# Altium schematic sheet Схема питания и GPS Peggy Tracker.SchDoc
size 420 x 297 mm; ENG_APP_DATE: --/--/--; DSN_APP_DATE: --/--/--; CHK_APP_DATE: --/--/--; Scale: 1:1; Разраб.: Иванов; Обозначение документа: АБВГ.123456.001 Э3; Пров.: Петров; Утв.: Сидоров; Наименование организации: ОАО "Ваша фирма"; Перв. применение: АБВГ.123456.000; Наименование изделия 1: Плата; Наименование изделия 2: Схема электрическая; Наименование изделия 3: принципиальная; Нач. отд.: Нач. отд.; Фамилия нач. отд.: Сидоров
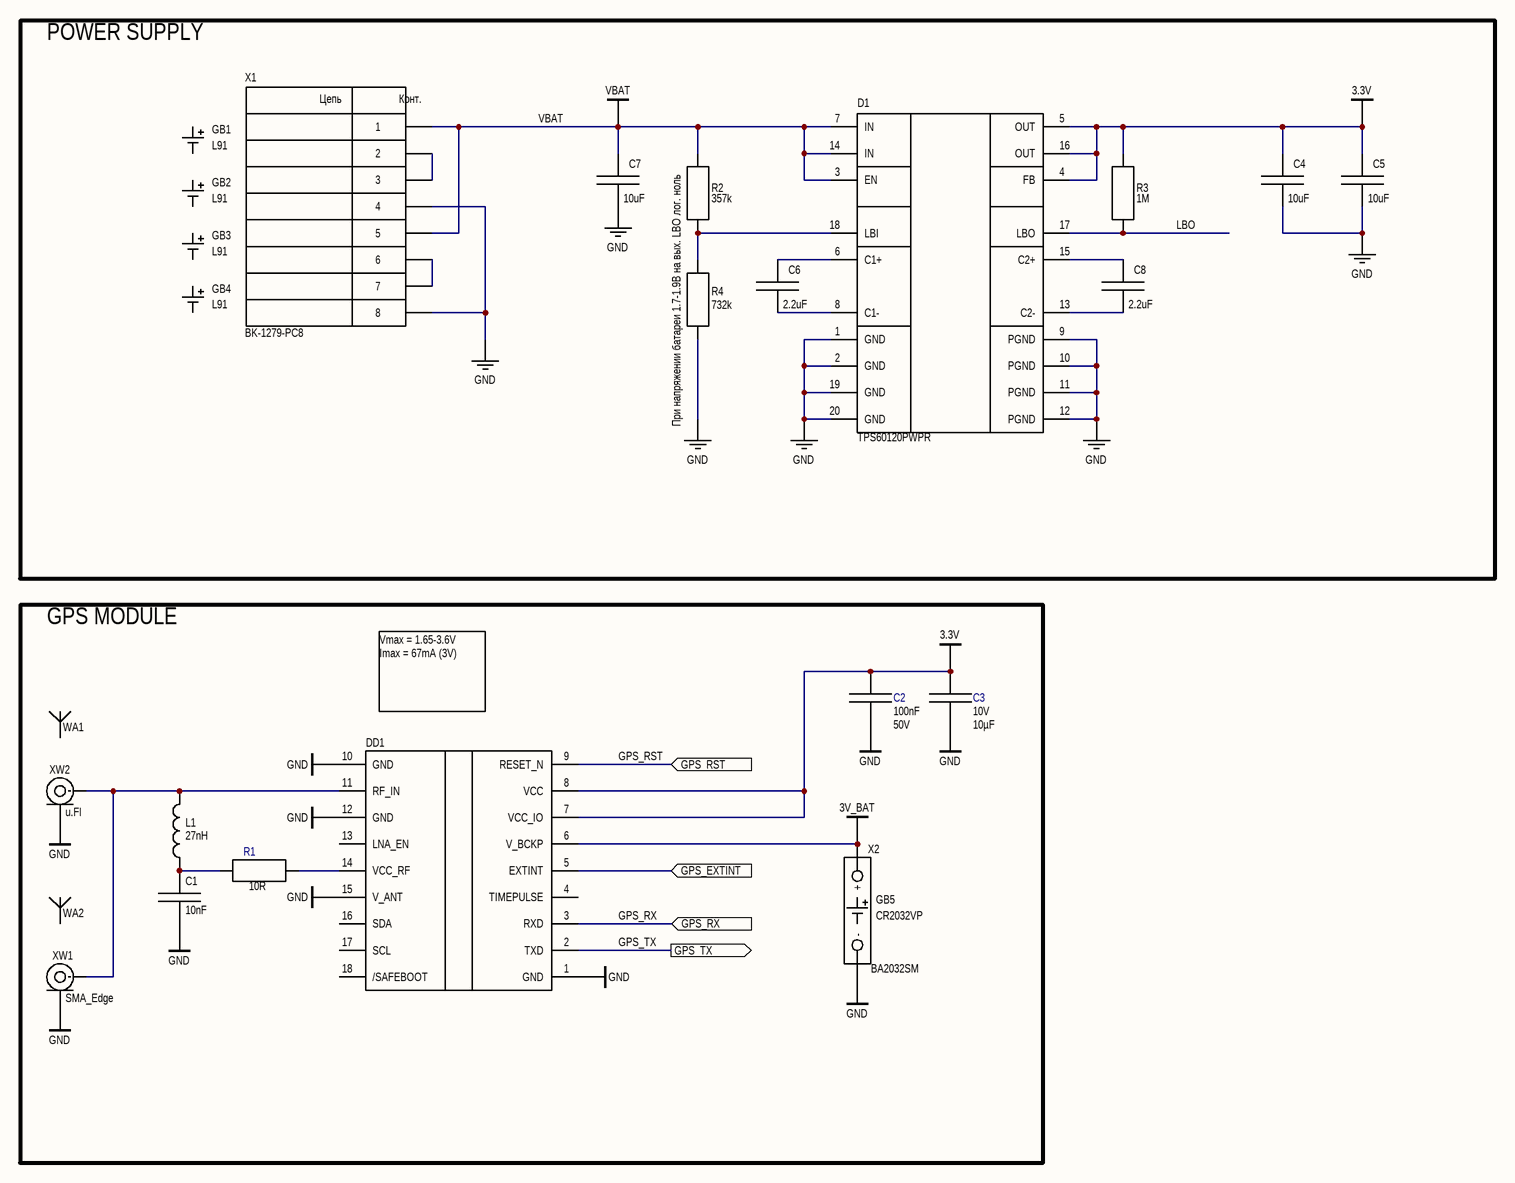
[diagram p0: Схема питания и GPS Peggy Tracker.SchDoc]

## Parts
C1  10nF  [CH0603C]
C2  value 100nF  Voltage Rating: 50V  [CAPC1608X09N]  (hidden comment: GCM188R71H104KA57D)
C3  Voltage Rating: 10V  Capacitance: 10µF  [CAPC2013X135X45NL10T25]  (hidden comment: CL21Y106KPQVPNE)
C4  10uF  [CH1206C]
C5  10uF  [CH1206C]
C6  2.2uF  [CH0805C]
C7  10uF  [CH1206C]
C8  2.2uF  [CH0805C]
D1  TPS60120PWPR  [20-TSSOP (PAD)]
DD1  MAX-M8C-0  [MOD: MAX-M8C-0]  (value not drawn)
GB1  L91
GB2  L91
GB3  L91
GB4  L91
GB5  CR2032VP
L1  27nH  [CH0603L]
R1  10R  [CH0603R]
R2  357k  [CH0603R]
R3  1M  [CH0603R]
R4  732k  [CH0603R]
WA1  CRJKS0010-LNA-G65U  (value not drawn)
WA2  MIKE3A/3M/SMAM/S/S/17  (value not drawn)
X1  BK-1279-PC8  [CON: BK-1279-PC8]
X2  BA2032SM  [CON: BA2032SM]
XW1  SMA_Edge  [CON: SMA - Edge]
XW2  u.Fl  [CON: u.Fl]

## Blocks framed on the sheet
POWER SUPPLY: C4-C8 D1 GB1-GB4 R2-R4 X1
GPS MODULE: C1-C3 DD1 GB5 L1 R1 WA1 WA2 X2 XW1 XW2

## Ports
GPS_EXTINT (in), GPS_RST (in), GPS_RX (in), GPS_TX (out)

## Nets
3.3V: C2.1 C3.2 C4.1 C5.1 D1.4(FB) D1.5(OUT) D1.16(OUT) DD1.7(VCC_IO) DD1.8(VCC) R3.2
3V_BAT: DD1.6(V_BCKP) X2.1(+)
GND: C1.2 C2.2 C3.1 C4.2 C5.2 C7.2 D1.1(GND) D1.2(GND) D1.9(PGND) D1.10(PGND) D1.11(PGND) D1.12(PGND) D1.19(GND) D1.20(GND) DD1.1(GND) DD1.10(GND) DD1.12(GND) DD1.15(V_ANT) R4.1 X1.4 X1.8 X2.2(-) XW1.2(IN) XW2.2(IN)
VBAT: C7.1 D1.3(EN) D1.7(IN) D1.14(IN) R2.2 X1.1 X1.5
GPS_EXTINT: DD1.5(EXTINT) ; port GPS_EXTINT
GPS_RST: DD1.9(RESET_N) ; port GPS_RST
GPS_RX: DD1.3(RXD) ; port GPS_RX
GPS_TX: DD1.2(TXD) ; port GPS_TX
LBO: D1.17(LBO) R3.1
NetC1_1: C1.1 L1.1 R1.1
NetC6_1: C6.1 D1.6(C1+)
NetC6_2: C6.2 D1.8(C1-)
NetC8_1: C8.1 D1.15(C2+)
NetC8_2: C8.2 D1.13(C2-)
NetD1_18: D1.18(LBI) R2.1 R4.2
NetDD1_11: DD1.11(RF_IN) L1.2 XW1.1(IN) XW2.1(IN)
NetDD1_14: DD1.14(VCC_RF) R1.2
NetX1_2: X1.2 X1.3
NetX1_6: X1.6 X1.7

Not connected (* = marked no-connect by the designer): DD1 4(TIMEPULSE) 13(LNA_EN) 16(SDA) 17(SCL) 18(/SAFEBOOT); GB1 1(+) 2(-); GB2 1(+) 2(-); GB3 1(+) 2(-); GB4 1(+) 2(-); GB5 1(+) 2(-); WA1 1; WA2 1

## Notes on the sheet
- При напряжении батареи 1.7-1.9В на вых. LBO лог. ноль
- (near DD1) Vmax = 1.65-3.6V
  Imax = 67mA (3V)
- Перв. примен.
- Справ. №
- Подп. и дата
- Инв. № дубл.
- Взам. инв. №
- Разраб.
- Изм.
- Лист
- № докум.
- Подп.
- Дата
- Лит.
- Масса
- Масштаб
- Пров.
- Т.контр.
- Листов
- Инв. № подл.
- Утв.
- Н.контр.
- Копировал
- Формат А3
- (in symbol 8-Connector) Цепь; Конт.

## Library data of the parts
C1 = Capacitor: CAP CER 10000PF 50V X7R 0603; Manufacturer: Murata Electronics; Model: GCM188R71H103KA37D; HelpURL: https://www.digikey.com/en/products/detail/murata-electronics/GCM188R71H103KA37D/1641652?s=N4IgTCBcDaIOIGECyBGAHGgSgdhQCRQAYBmAaQEFjsAREAXQF8g; ComponentKind: 0603 (1608 Metric); Value: 10nF; Supplier 1: Digi-Key; Supplier Part Number 1: 490-4778-1-ND
C2 = CMP-001-00128-5: CAP CER 0.1UF 50V X7R 0603; Manufacturer: Murata; Tolerance: 10%; Approvals: CSA,UR; Color: Grey; RoHS Compliant: Yes; Case/Package: 0603; Max Operating Temperature: 125°C; Min Operating Temperature: -55°C; Case Code (Metric): 1608; Depth: 0.8mm; Dielectric: X7R; Height: 0.8mm; Length: 1.6mm; Mount: Surface Mount; Package Quantity: 1; Packaging: Tape and Reel; Radiation Hardening: No; Series: GCM; Termination: SMD/SMT; Thickness: 0.035inch; Width: 0.031inch; Manufacturer Part Number: GCM188R71H104KA57D; Lead Free: Lead Free; REACH SVHC: No SVHC; Voltage: 50V; ComponentLink1Description: https://datasheet.ciiva.com/16624/product-16624562.pdf?src-supplier=Avnet+Europe; ComponentLink1URL: https://datasheet.ciiva.com/16624/product-16624562.pdf?src-supplier=Avnet+Europe; ComponentLink2Description: https://datasheet.ciiva.com/133/product-133574.pdf?src-supplier=Digi-Key; ComponentLink2URL: https://datasheet.ciiva.com/133/product-133574.pdf?src-supplier=Digi-Key; ComponentLink3Description: https://datasheet.ciiva.com/133/product-133575.pdf?src-supplier=Digi-Key; ComponentLink3URL: https://datasheet.ciiva.com/133/product-133575.pdf?src-supplier=Digi-Key; ComponentLink4Description: https://datasheet.ciiva.com/18183/getdatasheetpartid-98693-18183626.pdf?src-supplier=Verical; ComponentLink4URL: https://datasheet.ciiva.com/18183/getdatasheetpartid-98693-18183626.pdf?src-supplier=Verical; ComponentLink5Description: https://datasheet.ciiva.com/11786/0900766b80ef92d0-11786863.pdf?src-supplier=RSComponents; ComponentLink5URL: https://datasheet.ciiva.com/11786/0900766b80ef92d0-11786863.pdf?src-supplier=RSComponents; ComponentLink6Description: https://datasheet.ciiva.com/133/product-133573.pdf?src-supplier=Digi-Key; ComponentLink6URL: https://datasheet.ciiva.com/133/product-133573.pdf?src-supplier=Digi-Key; ComponentLink7Description: https://datasheet.ciiva.com/2989/product-2989242.pdf?src-supplier=Avnet; ComponentLink7URL: https://datasheet.ciiva.com/2989/product-2989242.pdf?src-supplier=Avnet; ComponentLink8Description: https://datasheet.ciiva.com/16497/product-16497247.pdf?src-supplier=Future+Electronics; ComponentLink8URL: https://datasheet.ciiva.com/16497/product-16497247.pdf?src-supplier=Future+Electronics; Construction: Flat; Design Item ID: 1_16; Pricing 1: 1=0,11000, 10=0,07900, 50=0,04280, 100=0,03500, 500=0,02502, 1000=0,01966 (USD); Ratings: AEC-Q200; RoHS: Yes; Source: Meteo_1.SCHLIB; Stock 1: 4755830; Voltage Rating (DC): 50V
C3 = CMP-001-00143-4: CAP CER 10UF 10V X7S 0805; Manufacturer: Samsung; Value: 10µF; Tolerance: 10%; Manufacturer Part Number: CL21Y106KPQVPNE; Packaging: Tape and Reel; Max Operating Temperature: 125°C; RoHS Compliant: Yes; Case/Package: 0805; Features: Soft Termination; Case Code (Imperial): 0805; Thickness: 0.055inch; Length: 0.079inch; Min Operating Temperature: -55°C; Width: 0.049inch; Ratings: AEC-Q200; Mount: Surface Mount; Case Code (Metric): 2012; Lead Free: Lead Free
C4 C5 C7 = Capacitor: Cap Ceramic 10uF 16V X7R 20% SMD 1206 125°C Embossed T/R; Manufacturer: Samsung Electro-Mechanics; Model: CL31B106MOHNNNE; HelpURL: https://www.digikey.com/en/products/detail/samsung-electro-mechanics/CL31B106MOHNNNE/5961125; ComponentKind: 1206 (3216 Metric); Value: 10uF; Supplier 1: Digi-Key; Supplier Part Number 1: 1276-6641-1-ND; Manufacturer Part Number: CL31B106MOHNNNE; RoHS: Yes; Category: Ceramic Capacitors; Stock: 1126; Pricing: 1=0,22000, 10=0,15000, 50=0,09000, 100=0,07600, 500=0,05202, 1000=0,04602 (USD); Mount: Surface Mount; Case/Package: 1206; Case Code (Metric): 3216; Case Code (Imperial): 1206; Min Operating Temperature: -55°C; Max Operating Temperature: 125°C; Capacitance: 10uF; Tolerance: 20%; Dielectric: X7R; Voltage Rating (DC): 16V; Packaging: Tape and Reel; Voltage Rating: 16V; Length: 0.126inch; Width: 0.063inch; Thickness: 0.071inch; RoHS Compliant: Yes; ComponentLink1URL: http://www.samsungsem.com/kr/support/product-search/mlcc/CL31B106MOHNNNE.jsp?src-supplier=Digi-Key; ComponentLink1Description: http://www.samsungsem.com/kr/support/product-search/mlcc/CL31B106MOHNNNE.jsp?src-supplier=Digi-Key
C6 C8 = Capacitor: Cap Ceramic 10uF 16V X7R 20% SMD 1206 125°C Embossed T/R; Manufacturer: Murata Electronics; Manufacturer Part Number: CL31B106MOHNNNE; Model: GRM21BR71E225KE11L; Voltage Rating: 25V; HelpURL: https://www.digikey.com/en/products/detail/murata-electronics/GRM21BR71E225KE11L/6606096; ComponentKind: 0805 (2012 Metric); Value: 2.2uF; RoHS: Yes; Category: Ceramic Capacitors; Stock: 1126; Pricing: 1=0,22000, 10=0,15000, 50=0,09000, 100=0,07600, 500=0,05202, 1000=0,04602 (USD); Mount: Surface Mount; Case/Package: 0805; Case Code (Metric): 3216; Min Operating Temperature: -55°C; Max Operating Temperature: 125°C; Capacitance: 2.2uF; Tolerance: 20%; Dielectric: X7R; Voltage Rating (DC): 16V; Packaging: Tape and Reel; Length: 0.126inch; Width: 0.063inch; Thickness: 0.071inch; RoHS Compliant: Yes; ComponentLink1URL: http://www.samsungsem.com/kr/support/product-search/mlcc/CL31B106MOHNNNE.jsp?src-supplier=Digi-Key; ComponentLink1Description: http://www.samsungsem.com/kr/support/product-search/mlcc/CL31B106MOHNNNE.jsp?src-supplier=Digi-Key; Supplier 1: Digi-Key; Supplier Part Number 1: 490-14467-1-ND
D1 = TPS60120PWPR: Charge Pump Switching Regulator 3.3V; Manufacturer: Texas Instruments; Model: TPS60120PWPR; HelpURL: https://www.digikey.com/en/products/detail/texas-instruments/TPS60120PWPR/1671965; ComponentKind: PowerTSSOP; Supplier 1: Digi-Key; Supplier Part Number 1: 296-48756-1-ND
DD1 = MAX-M8C-0: RF RCVR GNSS/GPS 1.575GHZ 18LCC; Manufacturer: U-Blox; Model: MAX-M8C-0; ComponentKind: Surface Mount; HelpURL: https://www.digikey.com/en/products/detail/u-blox/MAX-M8C-0/6150635?s=N4IgTCBcDaILIEEAaBaOAOAwigDCAugL5A; Supplier 1: Digi-Key; Supplier Part Number 1: 672-MAX-M8C-0CT-ND
GB1-GB5 = Battery_1CELL: Manufacturer: Energizer Battery Company; Supplier 1: Digi-Key
  GB1-GB4: Model: L91; HelpURL: https://www.digikey.com/en/products/detail/energizer-battery-company/L91/704843?s=N4IgjCBcpgnAHLKoDGUBmBDANgZwKYA0IA9lANogAMIAugL7EC0ATMiGpAC4BOArkVIUQAVjr1GINpEoAZWGAAEAUQB2%2BHgHMAlgC8NisADoRANTrEx0EAAcoYYjbuQwVKhKA; ComponentKind: AA; Supplier Part Number 1: N602-ND
  GB5: Model: CR2032VP; HelpURL: https://www.digikey.com/en/products/detail/energizer-battery-company/CR2032VP/704858?s=N4IgTCBcDaIMICUwAYDMYBqAFEBdAvkA; ComponentKind: Coin, 20.0mm; Supplier Part Number 1: N189-ND
L1 = Inductor: Manufacturer: Murata Electronics; Model: LQW18AN27NJ00D; HelpURL: https://www.digikey.com/en/products/detail/murata-electronics/LQW18AN27NJ00D/584382?s=N4IgTCBcDaIDIEUDqBGAHAQQHJgOxYCkAGIgERAF0BfIA; ComponentKind: 0603 (1608 Metric); Value: 27nH; Supplier 1: Digi-Key; Supplier Part Number 1: 490-1174-1-ND
R1 = Resistor: RES 10 OHM 5% 1/3W 0603; Manufacturer: KOA Speer Electronics, Inc.; Model: SG73P1JTTD100J; HelpURL: https://www.digikey.com/en/products/detail/koa-speer-electronics-inc/SG73P1JTTD100J/10187128?s=N4IgTCBcDaIMoHEDsBmACgRgFIBUcBEMAGIrEAXQF8g; ComponentKind: 0603 (1608 Metric); Value: 10R; Supplier 1: Digi-Key; Supplier Part Number 1: 2019-SG73P1JTTD100JCT-ND
R2 = Resistor: Manufacturer: YAGEO; Model: RC0603FR-07357KL; HelpURL: https://www.digikey.com/en/products/detail/yageo/RC0603FR-07357KL/727177*; ComponentKind: 0603 (1608 Metric); Value: 357k; Supplier 1: Digi-Key; Supplier Part Number 1: 311-357KHRCT-ND
R3 = Resistor: Manufacturer: YAGEO; Model: RC0603FR-071ML; HelpURL: https://www.digikey.com/en/products/detail/yageo/RC0603FR-071ML/726844; ComponentKind: 0603 (1608 Metric); Value: 1M; Supplier 1: Digi-Key; Supplier Part Number 1: 311-1.00MHRCT-ND
R4 = Resistor: Manufacturer: YAGEO; Model: RC0603FR-07732KL; HelpURL: https://www.digikey.com/en/products/detail/yageo/RC0603FR-07732KL/727376; ComponentKind: 0603 (1608 Metric); Value: 732k; Supplier 1: Digi-Key; Supplier Part Number 1: 311-732KHRCT-ND
WA1 = Antenna 1pin: 1.583GHz GPS Ceramic Patch RF Antenna 1.559GHz ~ 1.610GHz 17dBi - -; Manufacturer: NimbeLink, LLC; Model: CRJKS0010-LNA-G65U; HelpURL: https://www.digikey.com/en/products/detail/nimbelink-llc/CRJKS0010-LNA-G65U/15519589; ComponentKind: *; Supplier 1: Digi-Key; Supplier Part Number 1: 1477-CRJKS0010-LNA-G65U-ND
WA2 = Antenna 1pin: 1.575GHz GPS Module RF Antenna - 28dB SMA Male Adhesive, Magnetic; Manufacturer: Siretta Ltd; Model: MIKE3A/3M/SMAM/S/S/17; HelpURL: https://www.digikey.com/en/products/detail/siretta-ltd/MIKE3A-3M-SMAM-S-S-17/6096367; ComponentKind: SMA Male; Supplier 1: Digi-Key; Supplier Part Number 1: MIKE3A/3M/SMAM/S/S/17-ND
X1 = 8-Connector: BATTERY HOLDER AA 4 CELL PC PIN; Manufacturer: MPD (Memory Protection Devices); Model: BK-1279-PC8; HelpURL: https://www.digikey.com/en/products/detail/mpd-memory-protection-devices/BK-1279-PC8/1640077; ComponentKind: PC Pin; Supplier 1: Digi-Key; Supplier Part Number 1: BK-1279-PC8-ND
X2 = Holder_1Cell: Manufacturer: MPD (Memory Protection Devices); Model: BA2032SM; HelpURL: https://www.digikey.com/en/products/detail/mpd-memory-protection-devices/BA2032SM/257743?s=N4IgTCBcDaIEIEEwAYDMYDKBZEBdAvkA; ComponentKind: 20.0mm 1 Cell SMD (SMT) Tab; Supplier 1: Digi-Key; Supplier Part Number 1: BA2032-ND
XW1 = SMA: RF; Manufacturer: Molex; Model: 0732512120; HelpURL: https://www.digikey.com/en/products/detail/molex/0732512120/1465158?s=N4IgTCBcDaIOwGYwFYCMBaMqwAYQF0BfIA; ComponentKind: Board Edge; Supplier 1: Digi-Key; Supplier Part Number 1: WM5536-ND
XW2 = u.Fl: RF; Manufacturer: Hirose Electric Co Ltd; Model: CONUFL001-SMD-T; HelpURL: https://www.digikey.com/en/products/detail/linx-technologies-inc/CONUFL001-SMD-T/7427732?s=N4IgTCBcDaIMIHkByBVAYgGQAxYIwFoBlAWQBF8AVEAXQF8g; ComponentKind: Surface Mount Solder; Supplier 1: Digi-Key; Supplier Part Number 1: CONUFL001-SMD-TCT-ND